# EAGLE design interface_pwm_sma (EAGLE 7.2.0)
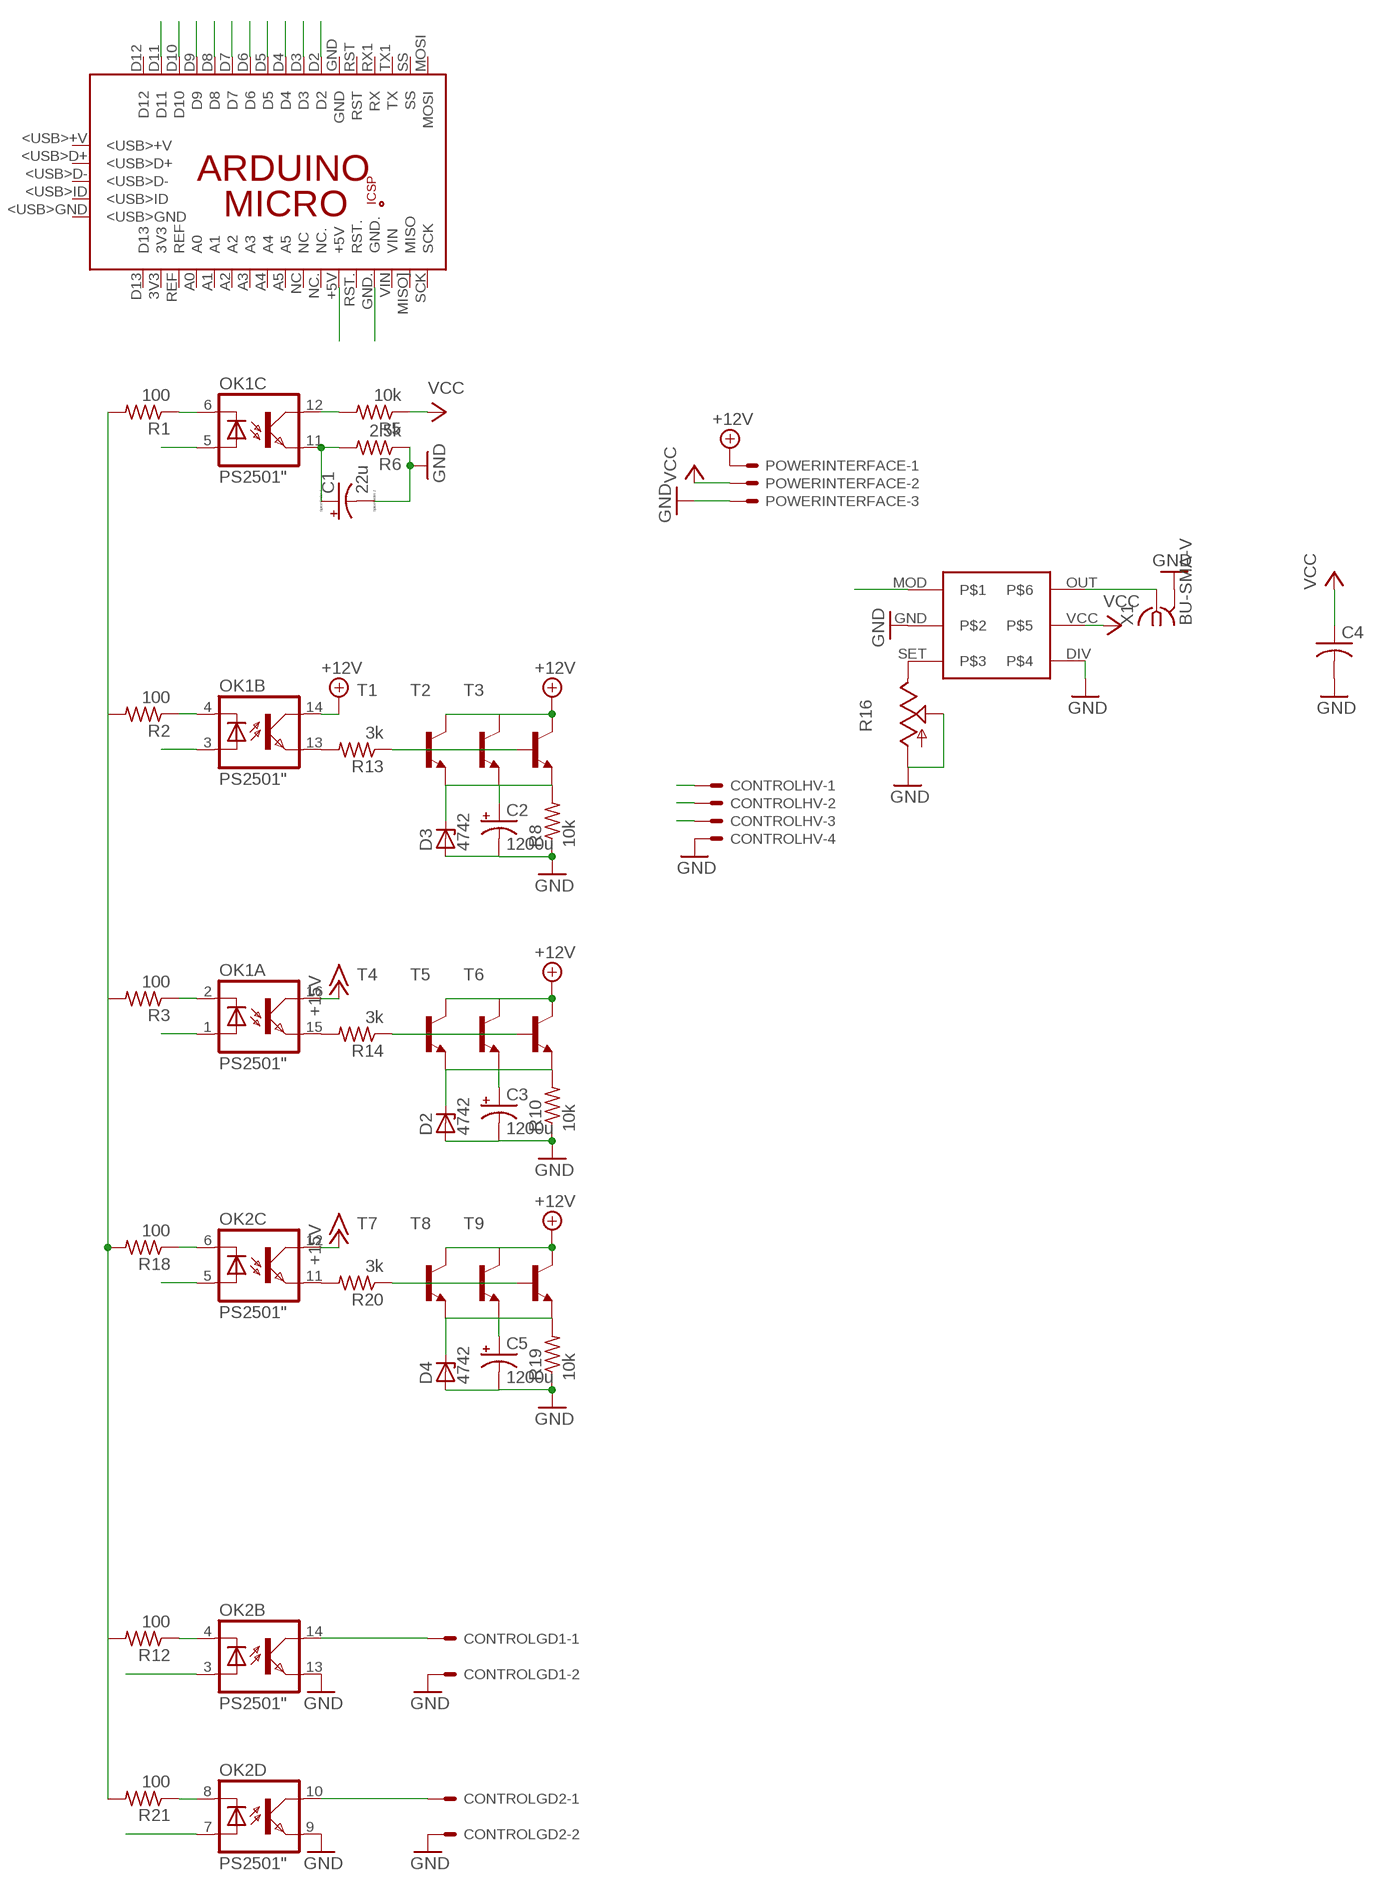
[diagram p0: schematic, sheet 1]

## Parts
C1  22u  CPOL-USE5-10.5  [E5-10,5]
C2  1200u  CPOL-USE10-20  [EB20D]
C3  1200u  CPOL-USE10-20  [EB20D]
C4  C-US075-063X106  [C075-063X106]
C5  1200u  CPOL-USE10-20  [EB20D]
CONTROLGD1  KK-156-2  [KK-156-2]
CONTROLGD2  KK-156-2  [KK-156-2]
CONTROLHV  KK-156-4  [KK-156-4]
D2  4742  ZENER-DIODEZD-10  [ZDIO-10]
D3  4742  ZENER-DIODEZD-10  [ZDIO-10]
D4  4742  ZENER-DIODEZD-10  [ZDIO-10]
OK1  PS2501"  [DIL16]
OK2  PS2501"  [DIL16]
PCB1  ARDUINO_MICRO  [ARDUINO_MICRO]
POWERINTERFACE  KK-156-3  [KK-156-3]
R1  100  R-US_0207/12  [0207/12]
R2  100  R-US_0207/12  [0207/12]
R3  100  R-US_0207/12  [0207/12]
R5  10k  R-US_0207/15  [0207/15]
R6  2.5k  R-US_0207/12  [0207/12]
R8  10k  R-US_0207/12  [0207/12]
R10  10k  R-US_0207/12  [0207/12]
R12  100  R-US_0207/12  [0207/12]
R13  3k  R-US_0207/15  [0207/15]
R14  3k  R-US_0207/15  [0207/15]
R16  TRIM_US-B90P  [SP19L]
R18  100  R-US_0207/12  [0207/12]
R19  10k  R-US_0207/12  [0207/12]
R20  3k  R-US_0207/15  [0207/15]
R21  100  R-US_0207/12  [0207/12]
T1  2N2222-NPN-TO92-EBC  [TO92-EBC]
T2  2N2222-NPN-TO92-EBC  [TO92-EBC]
T3  2N2222-NPN-TO92-EBC  [TO92-EBC]
T4  2N2222-NPN-TO92-EBC  [TO92-EBC]
T5  2N2222-NPN-TO92-EBC  [TO92-EBC]
T6  2N2222-NPN-TO92-EBC  [TO92-EBC]
T7  2N2222-NPN-TO92-EBC  [TO92-EBC]
T8  2N2222-NPN-TO92-EBC  [TO92-EBC]
T9  2N2222-NPN-TO92-EBC  [TO92-EBC]
U$1  LTC6992  [DIL06]
X1  BU-SMA-V  [BU-SMA-V]

## Nets
+15V: OK1.14(B:COL) OK1.16(A:COL) OK2.12(C:COL) POWERINTERFACE.1 T1.C T2.C T3.C T4.C T5.C T6.C T7.C T8.C T9.C ; supply symbol labelled +12V
A+5: PCB1.+5V
AGND: PCB1.GND. R1.2 R2.2 R3.2 R12.2 R18.2 R21.2
D2: PCB1.D2
D4: PCB1.D4
D7: PCB1.D7
D8: OK2.7(D:A) PCB1.D8
D10: OK2.3(B:A) PCB1.D10
D11: PCB1.D11
ENSW1: CONTROLGD1.1 OK2.14(B:COL)
ENSW2: CONTROLGD2.1 OK2.10(D:COL)
GND: C1.- C2.- C3.- C4.2 C5.- CONTROLGD1.2 CONTROLGD2.2 CONTROLHV.4 D2.A D3.A D4.A OK2.9(D:EMI) OK2.13(B:EMI) POWERINTERFACE.3 R6.1 R8.1 R10.1 R16.A R16.S R19.1 U$1.DIV U$1.GND X1.2 X1.3 X1.4 X1.5
N$2: OK2.4(B:C) R12.1
N$3: OK1.12(C:COL) R5.2
N$4: OK1.6(C:C) R1.1
N$5: OK1.4(B:C) R2.1
N$6: OK1.15(A:EMI) R14.2
N$7: OK2.6(C:C) R18.1
N$8: R20.1 T7.B T8.B T9.B
N$9: OK2.8(D:C) R21.1
N$10: OK1.2(A:C) R3.1
N$12: R16.E U$1.SET
N$13: U$1.OUT X1.1
N$14: OK1.13(B:EMI) R13.2
N$15: R13.1 T1.B T2.B T3.B
N$16: R14.1 T4.B T5.B T6.B
N$21: OK2.11(C:EMI) R20.2
PWM3: OK1.5(C:A) PCB1.D3
PWM5: OK1.3(B:A) PCB1.D5
PWM6: OK1.1(A:A) PCB1.D6
PWM9: OK2.5(C:A) PCB1.D9
PWMOUT: C1.+ OK1.11(C:EMI) R6.2 U$1.MOD
VCC: C4.1 POWERINTERFACE.2 R5.1 U$1.VCC
VREG1: C2.+ CONTROLHV.1 D3.C R8.2 T1.E T2.E T3.E
VREG2: C3.+ CONTROLHV.2 D2.C R10.2 T4.E T5.E T6.E
VREG3: C5.+ CONTROLHV.3 D4.C R19.2 T7.E T8.E T9.E
Unconnected: OK1.7(D:A) OK1.8(D:C) OK1.9(D:EMI) OK1.10(D:COL) OK2.1(A:A) OK2.2(A:C) OK2.15(A:EMI) OK2.16(A:COL) PCB1.3V3 PCB1.5V PCB1.<USB>+V PCB1.<USB>D+ PCB1.<USB>D- PCB1.<USB>GND PCB1.<USB>ID PCB1.A0 PCB1.A1 PCB1.A2 PCB1.A3 PCB1.A4 PCB1.A5 PCB1.D12 PCB1.D13 PCB1.GND PCB1.GND_ PCB1.MISO. PCB1.MISO](MISO) PCB1.MOSI PCB1.MOSI. PCB1.NC PCB1.NC. PCB1.REF PCB1.RESET.. PCB1.RST PCB1.RST. PCB1.RX1(RX) PCB1.SCK PCB1.SCK. PCB1.SS PCB1.TX1(TX) PCB1.VIN

## Library data of the parts
C1 = resistor:CPOL-US: POLARIZED CAPACITOR, American symbol
C2 C3 C5 = rcl:CPOL-US: POLARIZED CAPACITOR, American symbol
C4 = resistor:C-US: CAPACITOR, American symbol
CONTROLGD1 CONTROLGD2 = con-molex:KK-156-2: KK 156 HEADER Source: http://www.molex.com/pdm_docs/sd/026604100_sd.pdf; OC_FARNELL: unknown; OC_NEWARK: unknown
CONTROLHV = con-molex:KK-156-4: KK 156 HEADER Source: http://www.molex.com/pdm_docs/sd/026604100_sd.pdf; OC_FARNELL: unknown; OC_NEWARK: unknown
D2-D4 = diode:ZENER-DIODE: Z-Diode
OK1 OK2 = optocoupler:PS2501: SHARP OPTO COUPLER
PCB1 = E14_Arduino_published:ARDUINO_MICRO: Device for representing an Arduino Micro board with a footprint in an EAGLE design. Created by Dave Young for Element14. More EAGLE documentation at: http://www.element14.com/community/community/knode/cadsoft_eagle
POWERINTERFACE = con-molex:KK-156-3: KK 156 HEADER Source: http://www.molex.com/pdm_docs/sd/026604100_sd.pdf; OC_FARNELL: unknown; OC_NEWARK: unknown
R1-R3 R5 R6 R8 R10 R12-R14 R18-R21 = rcl:R-US_: RESISTOR, American symbol
R16 = pot:TRIM_US-: POTENTIOMETER
T1-T9 = transistor-neu-to92:*-NPN-: NPN Transistror
U$1 = linear-technology:LTC6992
X1 = con-coax:BU-SMA-V: FEMALE SMA CONNECTOR Radiall distributor RS 112-3794; OC_FARNELL: unknown; OC_NEWARK: unknown

## Board
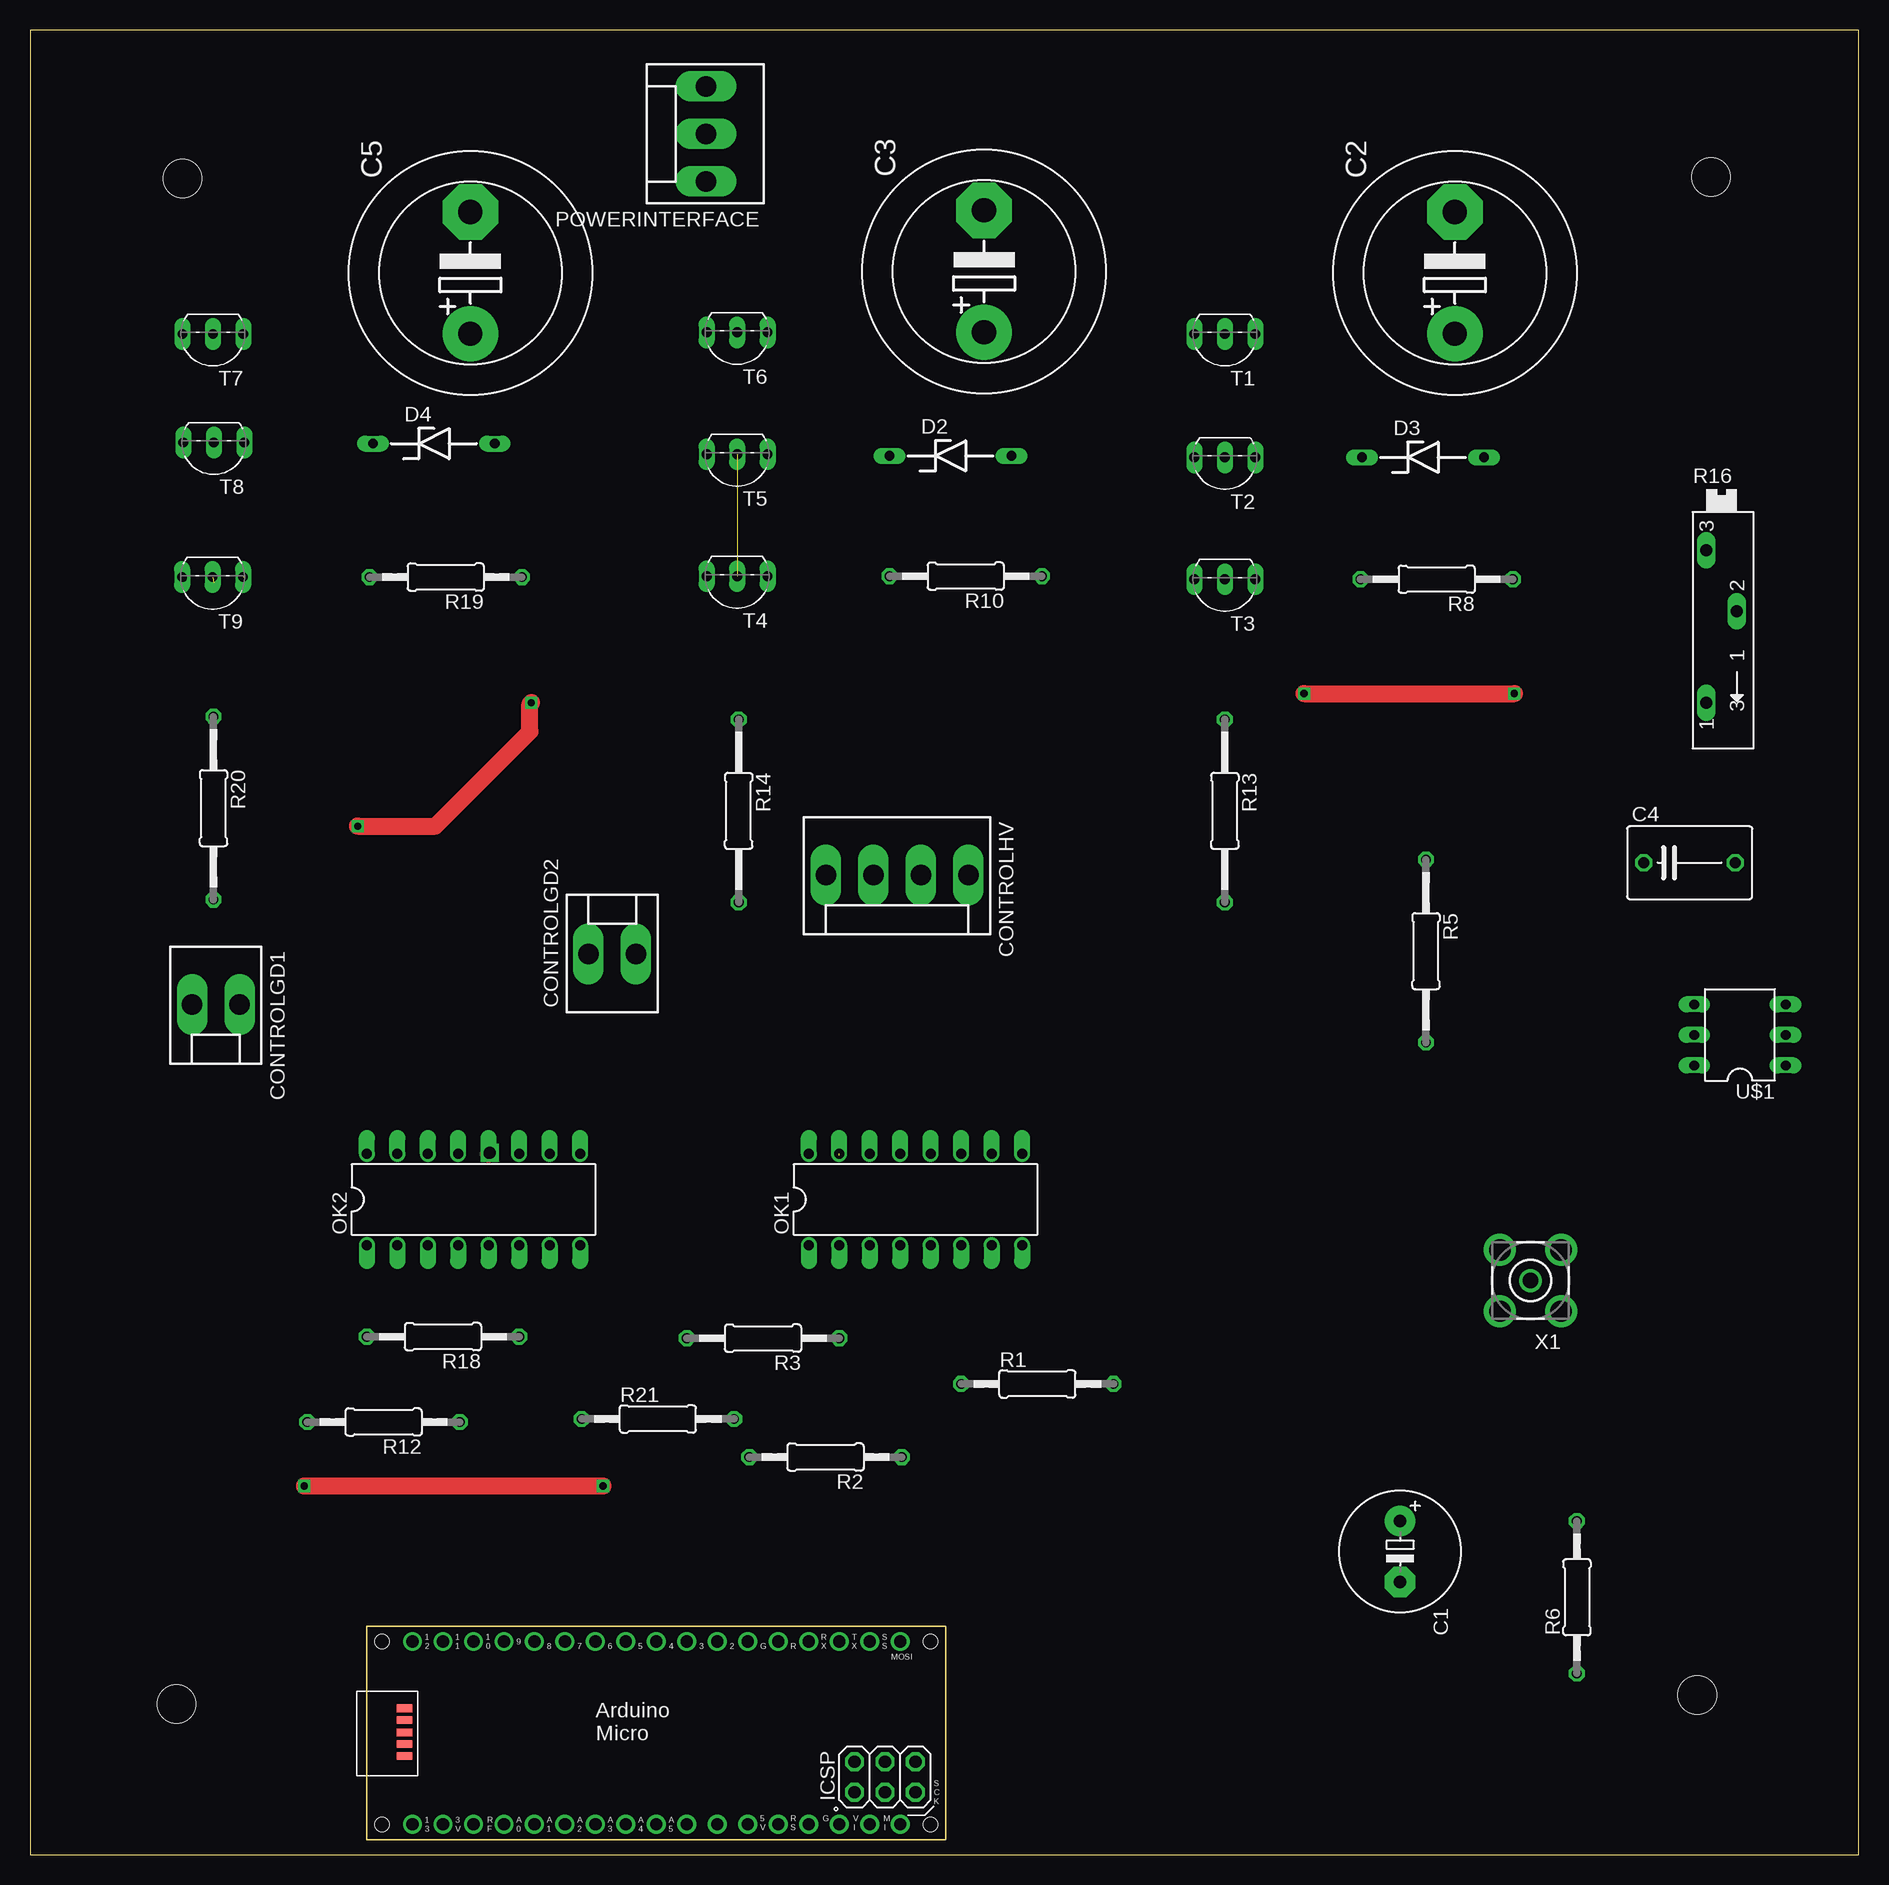
[diagram p1: board, top side]
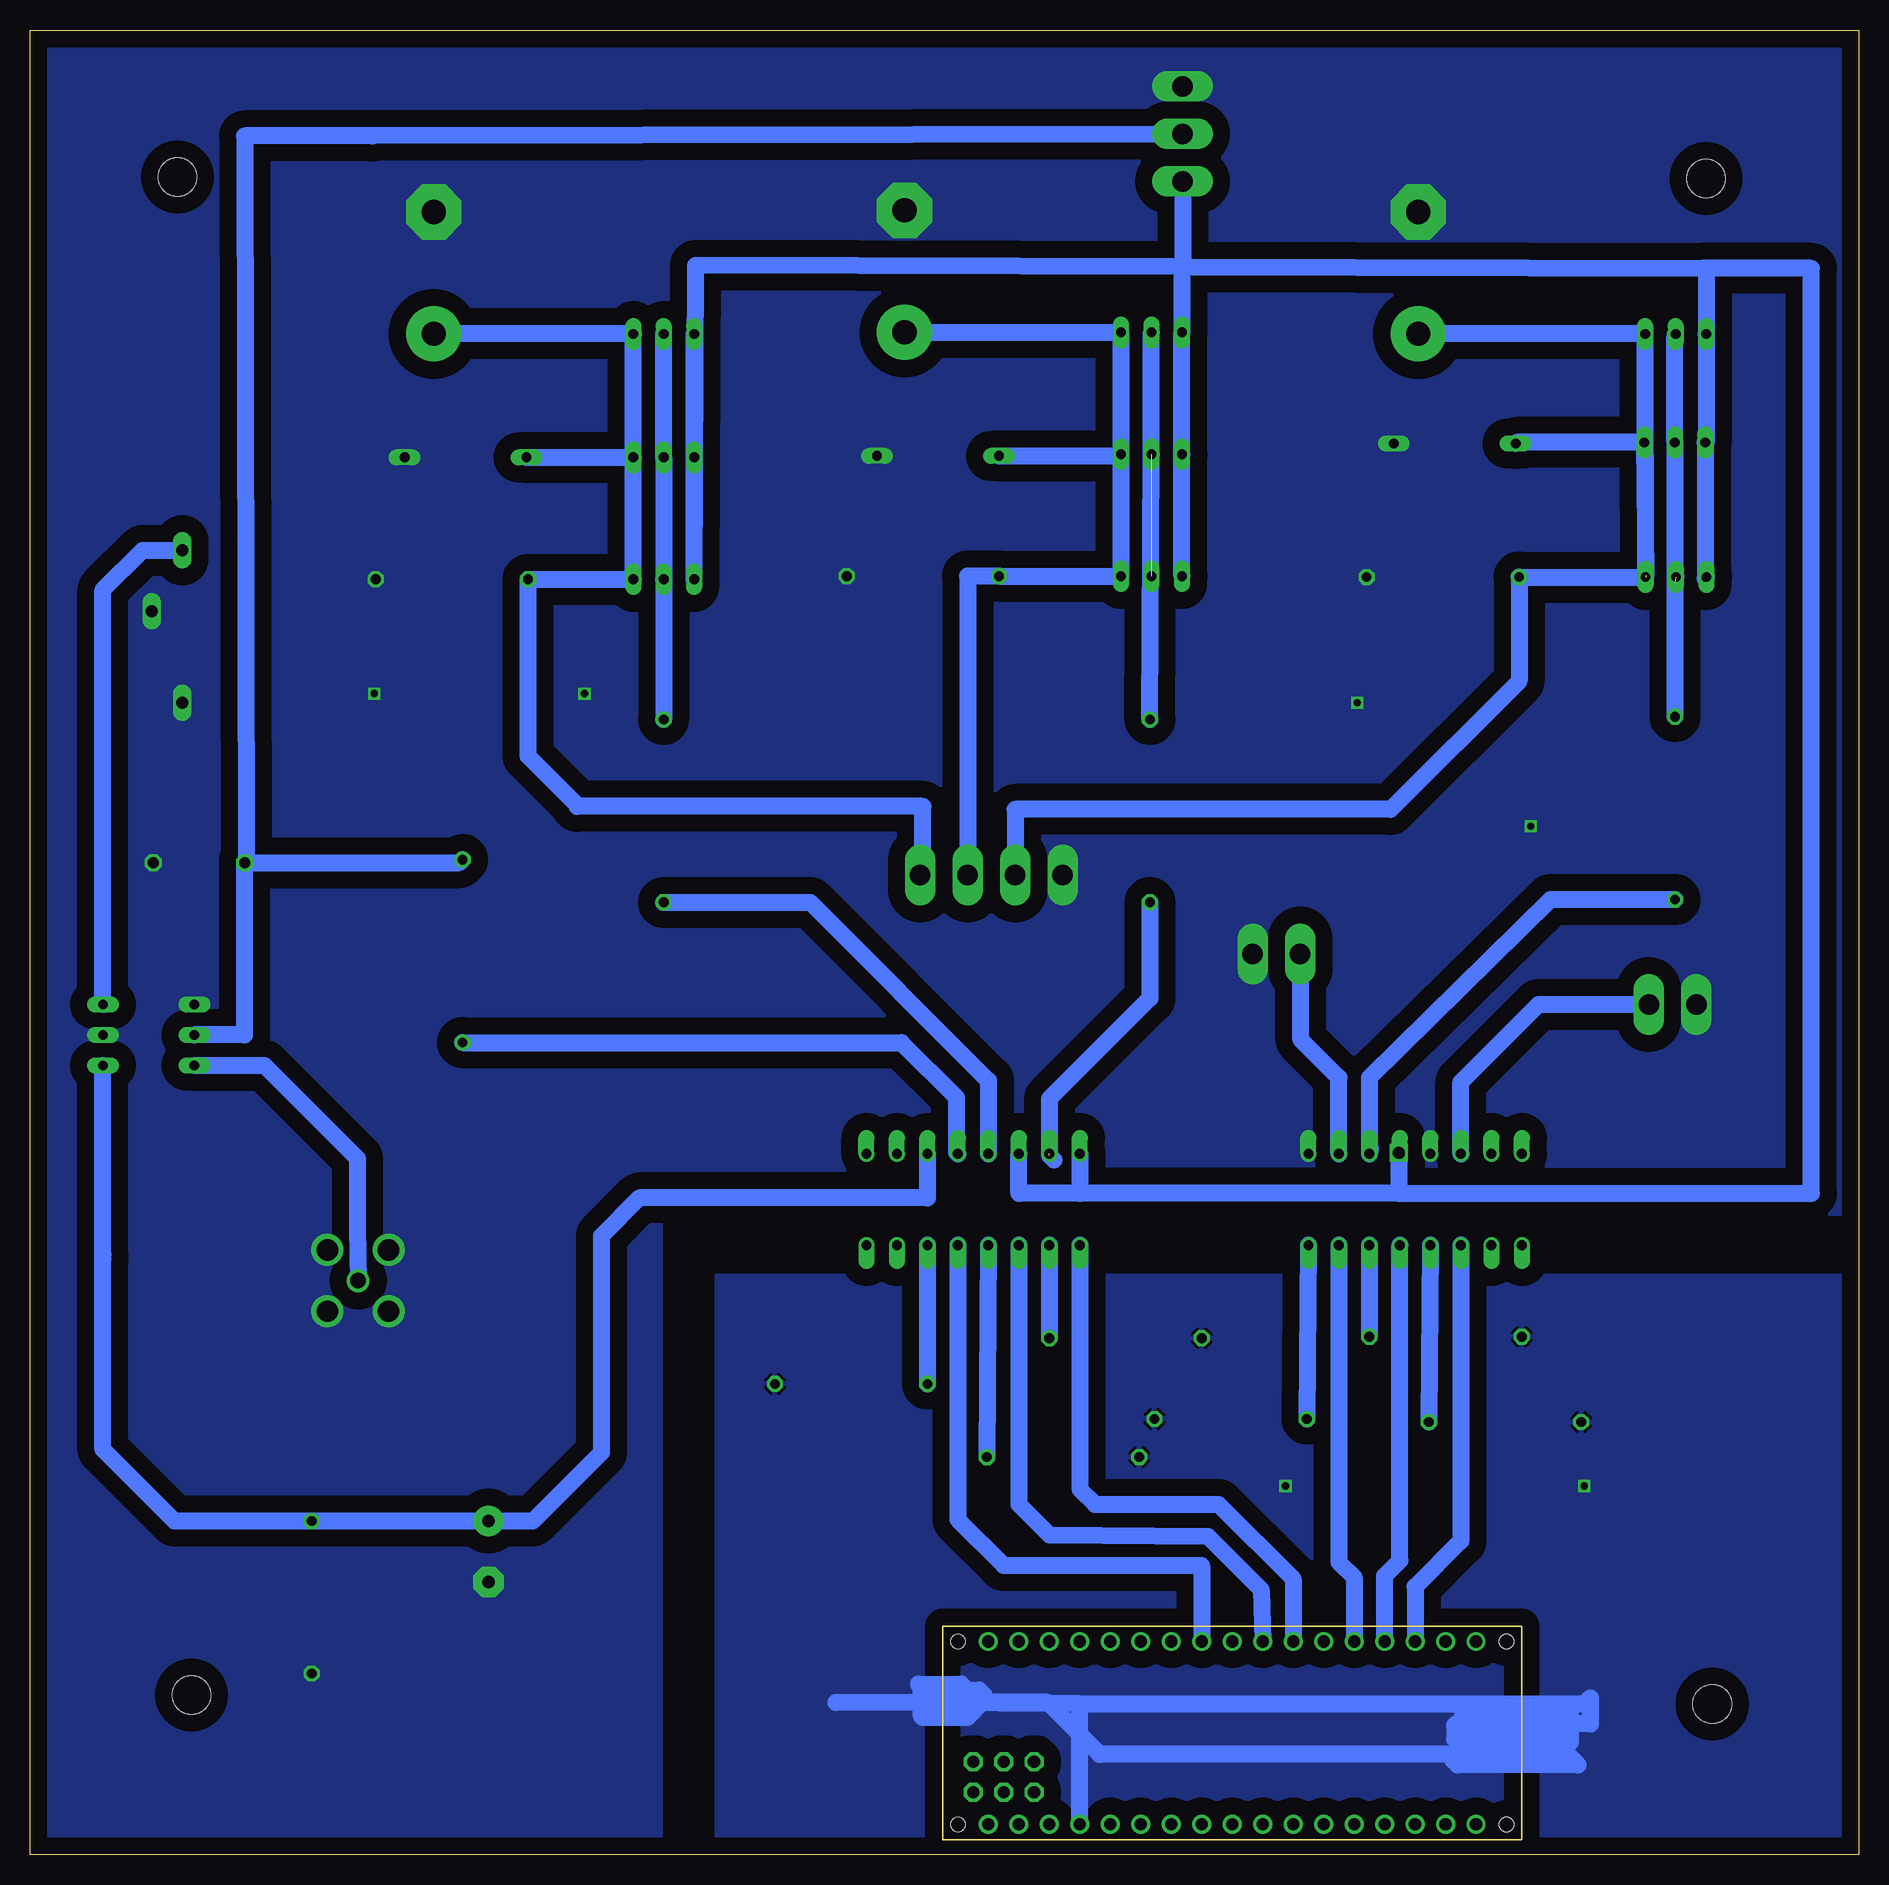
[diagram p2: board, bottom side, seen from below]

Size 152.38 x 152.07 mm. Coordinates in mm from the lower left corner, seen from the top.
Outline: 0,0 152.38,0 152.38,152.07 0,152.07 0,0
Copper layers (1*16): Top 0.035mm / dielectric 1.5mm / Bottom 0.035mm
Design rules "default": minimum track width 10mil, minimum drill 24mil, track to track 8mil, track to pad 8mil, pad to pad 8mil, via to via 8mil, smd to smd 8mil, copper to edge 40mil, drill to drill 8mil, minimum pad ring 10mil, minimum via ring 8mil, stop-mask expansion 4mil, vias tented up to drill 0mil, thermal gap 10mil
Holes 3.2 mm at 138.94,13.34 140.08,139.83 12.7,139.7 12.19,12.57

### Footprints (pad centres in the part's own frame; a part is rotated, then mirrored left to right if it is on the bottom)
E5-10,5 = drill 1.016 pad 2.54: + -2.54,0 | drill 1.016 pad 2.54 octagon: - 2.54,0
EB20D = drill 2.007 pad 4.597: + -5.08,0 | drill 2.007 pad 4.597 octagon: - 5.08,0
C075-063X106 = drill 0.914 octagon: 1 -3.81,0; 2 3.81,0
KK-156-2 = drill 1.7 pad 2.184 long: 1 -1.98,0; 2 1.98,0
KK-156-4 = drill 1.7 pad 2.184 long: 1 -5.94,0; 2 -1.98,0; 3 1.98,0; 4 5.94,0
ZDIO-10 = drill 0.813 long: A 5.08,0; C -5.08,0
DIL16 = drill 0.813 offset: 1 -8.89,-3.81; 2 -6.35,-3.81; 3 -3.81,-3.81; 4 -1.27,-3.81; 5 1.27,-3.81; 6 3.81,-3.81; 7 6.35,-3.81; 8 8.89,-3.81; 9 8.89,3.81; 10 6.35,3.81; 11 3.81,3.81; 12 1.27,3.81; 13 -1.27,3.81; 14 -3.81,3.81; 15 -6.35,3.81; 16 -8.89,3.81
ARDUINO_MICRO = drill 1.016 pad 1.575: 3V3 6.35,1.27; +5V 31.75,1.27; A0 11.43,1.27; A1 13.97,1.27; A2 16.51,1.27; A3 19.05,1.27; A4 21.59,1.27; A5 24.13,1.27; D2 29.21,16.51; D3 26.67,16.51; D4 24.13,16.51; D5 21.59,16.51; D6 19.05,16.51; D7 16.51,16.51; D8 13.97,16.51; D9 11.43,16.51; D10 8.89,16.51; D11 6.35,16.51; D12 3.81,16.51; D13 3.81,1.27; GND 31.75,16.51; GND. 36.83,1.27; MISO] 41.91,1.27; MOSI 44.45,16.51; NC 26.67,1.27; NC. 29.21,1.27; REF 8.89,1.27; RST 34.29,16.51; RST. 34.29,1.27; RX1 36.83,16.51; SCK 44.45,1.27; SS 41.91,16.51; TX1 39.37,16.51; VIN 39.37,1.27 | drill 1.016 pad 1.575 octagon: 5V 40.64,6.477; GND_ 45.72,6.477; MISO. 40.64,3.937; MOSI. 43.18,6.477; RESET.. 45.72,3.937; SCK. 43.18,3.937 | smd 1.27 x 0.635: <USB>+V 3.15,10.947; <USB>D+ 3.15,9.957; <USB>D- 3.15,8.941; <USB>GND 3.15,6.96; <USB>ID 3.15,7.976 | hole 1.2: 1.27,1.27; 1.27,16.51; 46.99,16.51; 46.99,1.27
KK-156-3 = drill 1.7 pad 2.184 long: 1 -3.96,0; 2 0,0; 3 3.96,0
0207/12 = drill 0.813 octagon: 1 -6.35,0; 2 6.35,0
0207/15 = drill 0.813 octagon: 1 -7.62,0; 2 7.62,0
SP19L = drill 1.016 long: A 5.715,-1.27; E -6.985,-1.27; S -1.905,1.27
TO92-EBC = drill 0.813 long: B 0,-1.27; C 2.54,-1.27; E -2.54,-1.27
DIL06 = drill 0.813 long: DIV 2.54,3.81; GND 0,-3.81; MOD -2.54,-3.81; OUT -2.54,3.81; SET 2.54,-3.81; VCC 0,3.81
BU-SMA-V = drill 1.27: 1 0,0 | drill 1.778: 2 -2.55,2.55; 3 2.55,2.55; 4 2.55,-2.55; 5 -2.55,-2.55

### Placement (x,y rotation side)
C1  114.17,25.27 270 top
C2  118.75,131.83 90 top
C3  79.5,131.95 90 top
C4  138.3,82.68 0 top
C5  36.7,131.83 90 top
CONTROLGD1  15.49,70.87 180 top
CONTROLGD2  48.51,75.06 0 top
CONTROLHV  72.26,81.66 180 top
D2  76.71,116.59 0 top
D3  116.08,116.46 0 top
D4  33.66,117.6 0 top
OK1  73.79,54.61 0 top
OK2  36.96,54.61 0 top
PCB1  28.07,1.27 0 top
POWERINTERFACE  56.34,143.41 90 top
R1  83.95,39.24 0 top
R2  66.29,33.15 180 top
R3  61.09,43.05 180 top
R5  116.33,75.31 270 top
R6  128.91,21.46 90 top
R8  117.22,106.3 180 top
R10  77.98,106.55 180 top
R12  29.46,36.07 180 top
R13  99.57,87 270 top
R14  59.05,87 270 top
R16  140.97,101.73 270 top
R18  34.42,43.18 180 top
R19  34.65,106.48 180 top
R20  15.29,87.22 270 top
R21  52.32,36.32 0 top
T1  99.57,125.48 180 top
T2  99.57,115.19 180 top
T3  99.57,105.03 180 top
T4  58.93,105.28 180 top
T5  58.93,115.44 180 top
T6  58.93,125.6 180 top
T7  15.24,125.48 180 top
T8  15.32,116.43 180 top
T9  15.21,105.21 180 top
U$1  142.49,68.33 90 top
X1  125.04,47.85 180 top

### Tracks (layer width: path | path; a pad name or v marks a point on that pad's centre or on a via)
+15V  (via drill 0.6, 1)
  Top 1.422: v38.3,58.5 OK2.12
  Bottom 1.422: T4.C T5.C T6.C 56.39,132.33 | T1.C T2.C T3.C 96.9,132.46 56.39,132.33 | T9.C v12.78,106.38 T8.C 12.7,117.63 T7.C 12.7,132.21 13.08,132.21 | 56.34,132.33 13.08,132.21 | POWERINTERFACE.1 56.34,132.33 | 56.34,132.33 56.39,132.33 | 38.3,55.12 3.94,55.12 3.94,132.21 13.08,132.21 | v38.3,58.5 38.3,55.12 | 38.3,55.12 64.9,55.12 | OK1.16 64.9,55.12 | 64.9,55.12 69.98,55.12 OK1.14
AGND  (via drill 0.6)
  Top 1.422: v47.75,30.73 v22.86,30.73
  Bottom 1.422: PCB1.GND. 64.9,12.57 | 64.9,12.57 85.22,12.7 | 64.9,12.57 22.86,12.57 22.35,13.08 22.35,10.92 33.53,10.92 33.66,10.79 33.66,9.65 33.15,9.14 24.26,9.14 24,9.4 24,11.56 24.13,11.68 32.89,11.68 33.02,11.56 33.02,9.91 25.27,9.91 25.27,9.4 23.37,7.49 33.4,7.49 33.78,7.87 33.4,7.87 32.77,8.51 24.77,8.51 24.64,8.38 63.25,8.38 67.56,12.7 73.03,12.7 74.3,11.43 77.98,11.43 78.11,11.56 78.11,13.97 78.36,14.22 74.8,14.22 74.3,13.72 73.28,13.72 72.9,13.34 77.72,13.34
  pour Bottom (isolate 1.422): 1.4,0 95.12,0 95.12,48.26 1.4,48.26
D8
  Bottom 1.422: OK2.7 43.31,24.38 42.04,23.11 PCB1.D8
D10
  Bottom 1.422: OK2.3 33.15,26.16 36.96,22.35 PCB1.D10
ENSW1
  Bottom 1.422: OK2.14 33.15,64.39 26.67,70.87 CONTROLGD1.1
ENSW2
  Bottom 1.422: OK2.10 43.31,64.77 46.48,67.94 46.48,75 CONTROLGD2.1
GND  (via drill 0.6)
  Top 1.422: v27.3,85.72 33.78,85.72 41.66,93.6 41.66,95.89 v41.78,96.01 | v106.17,96.77 v123.7,96.77
  pour Bottom (isolate 1.422, no thermals): 0,152.4 152.4,152.4 152.4,0 99.82,0 99.82,53.34 -0.13,53.47
N$2
  Bottom 1.422: OK2.4 R12.1
N$3
  Bottom 1.422: R5.2 79.76,67.69 75.18,63.12 75.18,58.55 OK1.12
N$4
  Bottom 1.422: OK1.6 R1.1
N$5
  Bottom 1.422: OK1.4 R2.1
N$6  (1 unrouted)
  Bottom 1.422: R14.2 59.05,71.37 67.44,62.99 67.44,58.29 67.06,57.91
N$7
  Bottom 1.422: OK2.6 R18.1
N$8  (1 unrouted)
  Bottom 1.422: T7.B 15.32,126.57 T8.B 15.32,105.99 | R20.1 15.27,106.66 T9.B
N$9
  Bottom 1.422: OK2.8 R21.1
N$10
  Bottom 1.422: OK1.2 R3.1
N$12
  Bottom 1.422: U$1.SET 146.3,105.41 143,108.71 R16.E
N$13
  Bottom 1.422: U$1.OUT 132.84,65.79 125.09,58.04 125.09,52.25 X1.1
N$14
  Bottom 1.422: R13.2 87.38,79.38 72.52,64.52 OK1.13
N$15
  Bottom 1.422: T1.B T2.B T3.B R13.1
N$16  (1 unrouted)
  Bottom 1.422: R14.1 T5.B T6.B
N$21
  Bottom 1.422: 40.69,58.88 OK2.11 40.77,64.77 25.68,79.6 R20.2
PWM3
  Bottom 1.422: OK1.5 75.06,27.94 71.25,24.13 54.74,24.13 PCB1.D3
PWM5
  Bottom 1.422: OK1.3 69.98,29.21 67.44,26.67 54.23,26.54 49.78,22.1 PCB1.D5
PWM6
  Bottom 1.422: OK1.1 64.9,30.48 63.63,29.21 53.34,29.21 47.12,22.99 PCB1.D6
PWM9
  Bottom 1.422: PCB1.D9 39.5,23.24 38.23,24.51 OK2.5
PWMOUT
  Bottom 1.422: OK1.11 77.6,54.74 101.6,54.74 104.78,51.56 104.78,33.53 110.49,27.81 C1.+ R6.2 140.34,27.81 146.3,33.78 146.3,49.66 146.3,50.04 U$1.MOD
VCC
  Bottom 1.422: U$1.VCC 134.49,68.33 C4.1 134.37,82.68 | POWERINTERFACE.2 56.34,143.38 123.83,143.26 134.49,143.26 134.37,82.68 | 134.37,82.68 116.59,82.68 R5.1
VREG1
  Bottom 1.422: T2.E T3.E R8.2 110.87,91.57 106.81,87.5 106.81,87.38 77.98,87.38 77.98,81.66 CONTROLHV.1 | T2.E T1.E C2.+ | D3.C T2.E
VREG2
  Bottom 1.422: T5.E T6.E C3.+ | T5.E T4.E R10.2 74.24,106.55 CONTROLHV.2 | D2.C 61.59,116.59 T5.E
VREG3  (1 unrouted)
  Bottom 1.422: D4.C 28.47,117.7 T8.E 17.73,106.63 T7.E C5.+ | T9.E R19.2 28.3,97.81 38.99,87.12 70.28,87.12 CONTROLHV.3